# Altium schematic sheet hallsensing.SchDoc
size A
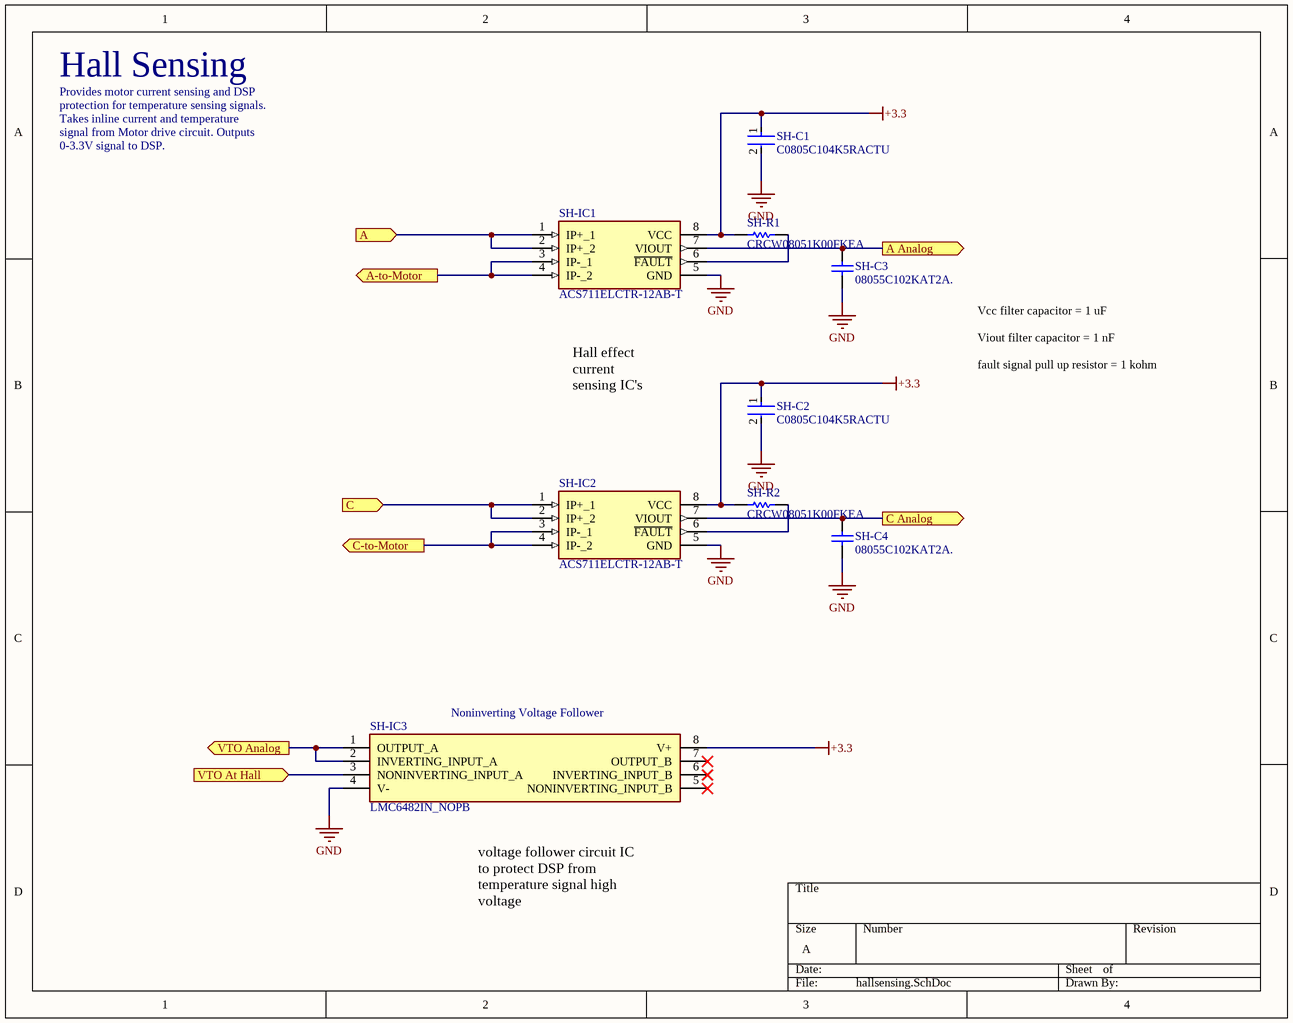
[diagram p0: hallsensing.SchDoc]

## Parts
SH-C1  C0805C104K5RACTU  [FP-C0805C-DN-MFG]
SH-C2  C0805C104K5RACTU  [FP-C0805C-DN-MFG]
SH-C3  08055C102KAT2A.  [CAPC2013X94X50ML20T25]
SH-C4  08055C102KAT2A.  [CAPC2013X94X50ML20T25]
SH-IC1  ACS711ELCTR-12AB-T  [SOIC127P600X175-8N]
SH-IC2  ACS711ELCTR-12AB-T  [SOIC127P600X175-8N]
SH-IC3  LMC6482IN_NOPB  [DIP794W53P254L959H508Q8N]
SH-R1  CRCW08051K00FKEA  [RESC2013X50X30NL20T20]
SH-R2  CRCW08051K00FKEA  [RESC2013X50X30NL20T20]

## Ports
A (in), A Analog (out), A-to-Motor (out), C (in), C Analog (out), C-to-Motor (out), VTO Analog (out), VTO At Hall (in)

## Nets
+3.3: SH-C1.1 SH-C2.1 SH-IC1.8(VCC) SH-IC2.8(VCC) SH-IC3.8(V+) SH-R1.1 SH-R2.1
GND: SH-C1.2 SH-C2.2 SH-C3.1 SH-C4.1 SH-IC1.5(GND) SH-IC2.5(GND) SH-IC3.4(V-)
A: SH-IC1.1(IP+_1) SH-IC1.2(IP+_2) ; port A
A Analog: SH-C3.2 SH-IC1.7(VIOUT) ; port A Analog
A-to-Motor: SH-IC1.3(IP-_1) SH-IC1.4(IP-_2) ; port A-to-Motor
C: SH-IC2.1(IP+_1) SH-IC2.2(IP+_2) ; port C
C Analog: SH-C4.2 SH-IC2.7(VIOUT) ; port C Analog
C-to-Motor: SH-IC2.3(IP-_1) SH-IC2.4(IP-_2) ; port C-to-Motor
VTO Analog: SH-IC3.1(OUTPUT_A) SH-IC3.2(INVERTING_INPUT_A) ; port VTO Analog
VTO At Hall: SH-IC3.3(NONINVERTING_INPUT_A) ; port VTO At Hall
NetSH-IC1_6: SH-IC1.6(~{FAULT}) SH-R1.2
NetSH-IC2_6: SH-IC2.6(~{FAULT}) SH-R2.2

Not connected (* = marked no-connect by the designer): SH-IC3 5(NONINVERTING_INPUT_B)* 6(INVERTING_INPUT_B)* 7(OUTPUT_B)*

## Notes on the sheet
- Hall Sensing
- Provides motor current sensing and DSP
- protection for temperature sensing signals.
- Takes inline current and temperature
- signal from Motor drive circuit. Outputs
- 0-3.3V signal to DSP.
- Hall effect current sensing IC's
- Vcc filter capacitor = 1 uF
  Viout filter capacitor = 1 nF
  fault signal pull up resistor = 1 kohm
- (near SH-IC3) Noninverting Voltage Follower
- voltage follower circuit IC to protect DSP from temperature signal high voltage

## Library data of the parts
SH-C1 SH-C2 = CMP-2007-00279-2: CAP CER 0.1UF 50V X7R 0805; Manufacturer: KEMET; Value: 0.10 μF; Tolerance: 0.1; Temperature Coefficient: 30ppm/°C; Manufacturer Part Number: C0805C104K5RACTU; Device Class L2: Capacitors; Temperature Range Low: -55°C; Voltage Rating: 50 V; Digikey Description: CAP CER 0.1UF 50V X7R 0805; Category: Cap; ComponentLink2Description: Datasheet; Octopart: https://octopart.com/c0805c104k5ractu-kemet-143926; RoHS: TRUE; ComponentLink2URL: https://content.kemet.com/datasheets/KEM_C1003_C0G_SMD.pdf; Temperature Characteristic: X7R; Temperature: -55°C to +125°C; Height: 0.88mm; Temperature Range High: +125°C; Device Class L1: Passive Components; Automotive: No; Lead Free: Yes; Ipc Land Pattern Name: CAPC200125X78; Material: Ceramic; Device Class L3: Ceramic Capacitors; Mouser Description: Cap Ceramic 0.1uF 50V X7R 10% SMD 2.0 x 1.2 mm 125 C Paper T/R; Capacitance: 0.10 μF; Package: C0805C-DN
SH-C3 SH-C4 = CMP-1036-02979-2: Manufacturer: AVX Interconnect / Elco; Part Number: 08055C102KAT2A.
SH-IC1 SH-IC2 = ACS711ELCTR-12AB-T: 12A current sensing Integrated Circuit; Manufacturer_Name: Allegro Microsystems; Datasheet Link: https://www.allegromicro.com/~/media/Files/Datasheets/ACS711-Datasheet.ashx; Height: 1.75mm; Manufacturer_Part_Number: ACS711ELCTR-12AB-T; Arrow Part Number: ACS711ELCTR-12AB-T; Arrow Price/Stock: https://www.arrow.com/en/products/acs711elctr-12ab-t/allegro-microsystems
SH-IC3 = LMC6482IN_NOPB: OP-AMP voltage follower Integrated Circuit; Manufacturer_Name: Texas Instruments; Manufacturer_Part_Number: LMC6482IN/NOPB; Datasheet Link: http://www.ti.com/lit/gpn/lmc6482; Height: 5.08mm; Mouser Part Number: 926-LMC6482IN/NOPB; Mouser Price/Stock: https://www.mouser.co.uk/ProductDetail/Texas-Instruments/LMC6482IN-NOPB?qs=QbsRYf82W3EByDDrj8Vijg%3D%3D; Arrow Part Number: LMC6482IN/NOPB; Arrow Price/Stock: https://www.arrow.com/en/products/lmc6482innopb/texas-instruments
SH-R1 SH-R2 = CMP-1013-00510-2: Manufacturer: Vishay Dale; Part Number: CRCW08051K00FKEA